# Altium schematic sheet voltage_conditioning.SchDoc
size A4; SheetNumber: 5; SheetTotal: 12
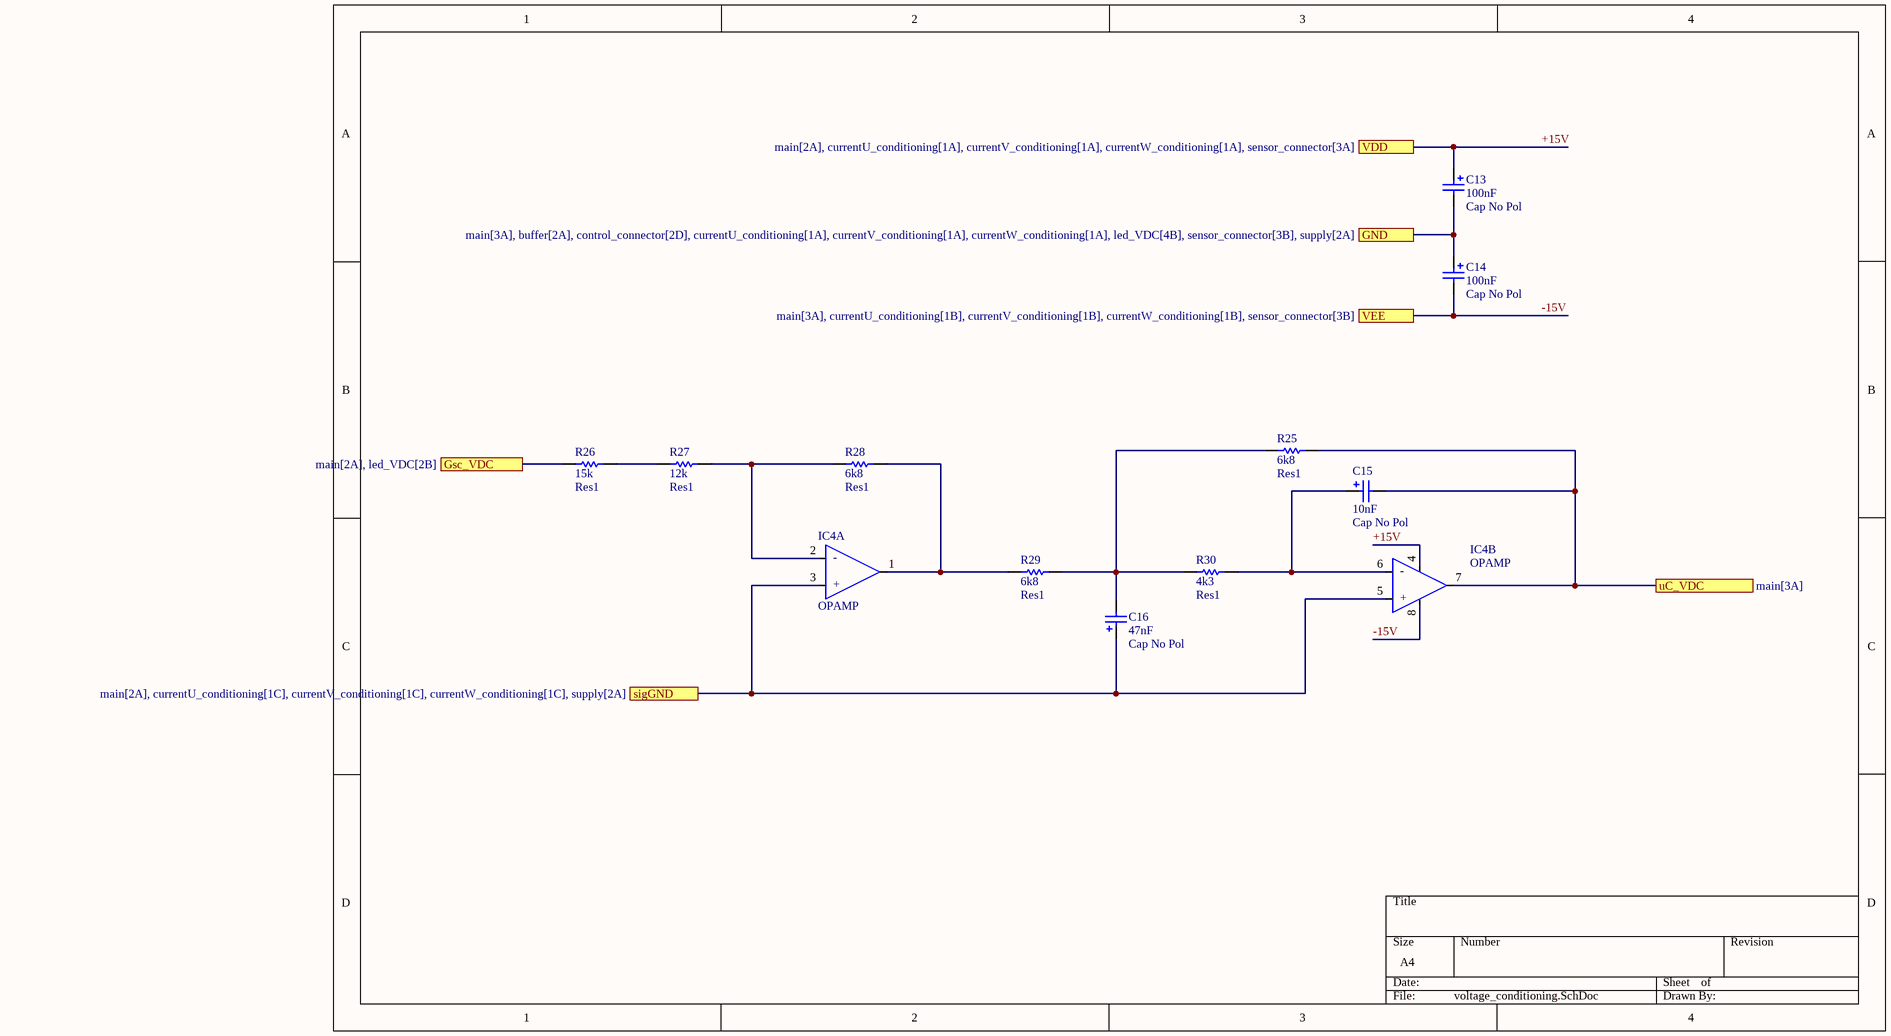
[diagram p0: voltage_conditioning.SchDoc]

## Parts
C13  Cap No Pol  value 100nF  [RAD-0.1]
C14  Cap No Pol  value 100nF  [RAD-0.1]
C15  Cap No Pol  value 10nF  [RAD-0.1]
C16  Cap No Pol  value 47nF  [RAD-0.1]
IC4  OPAMP  [DIP-8]  (parts A,B of 2)
R25  Res1  value 6k8  [AXIAL-0.3]
R26  Res1  value 15k  [AXIAL-0.3]
R27  Res1  value 12k  [AXIAL-0.3]
R28  Res1  value 6k8  [AXIAL-0.3]
R29  Res1  value 6k8  [AXIAL-0.3]
R30  Res1  value 4k3  [AXIAL-0.3]

## Ports
GND (see main[3A], buffer[2A], control_connector[2D], currentU_conditioning[1A], currentV_conditioning[1A], currentW_conditioning[1A], led_VDC[4B], sensor_connector[3B], supply[2A]), Gsc_VDC (see main[2A], led_VDC[2B]), sigGND (see main[2A], currentU_conditioning[1C], currentV_conditioning[1C], currentW_conditioning[1C], supply[2A]), uC_VDC (see main[3A]), VDD (see main[2A], currentU_conditioning[1A], currentV_conditioning[1A], currentW_conditioning[1A], sensor_connector[3A]), VEE (see main[3A], currentU_conditioning[1B], currentV_conditioning[1B], currentW_conditioning[1B], sensor_connector[3B])

## Nets
+15V: C13.1 IC4.4(-V) ; port VDD
-15V: C14.2 IC4.8(V+) ; port VEE
GND: C13.2 C14.1 ; port GND
Gsc_VDC: R26.1 ; port Gsc_VDC
sigGND: C16.1 IC4.3(IN_A_+) IC4.5(IN_B_+) ; port sigGND
uC_VDC: C15.2 IC4.7(OUT_B) R25.2 ; port uC_VDC
NetC15_1: C15.1 IC4.6(IN_B_-) R30.2
NetC16_2: C16.2 R25.1 R29.2 R30.1
NetIC4_1: IC4.1(OUT_A) R28.2 R29.1
NetIC4_2: IC4.2(IN_A_-) R27.2 R28.1
NetR26_2: R26.2 R27.1

## Notes on the sheet
- (in symbol ADTL082, part A) -; +
- (in symbol ADTL082, part B) -; +

## Library data of the parts
C13-C16 = Cap No Pol: Polarized Capacitor (Radial); Published: 8-Jun-2000; LatestRevisionDate: 17-Jul-2002; LatestRevisionNote: Re-released for DXP Platform.; PackageReference: RB7.6-15; Publisher: Altium Limited; PackageDescription: Polarized Capacitor (Radial); 2 Leads
IC4 = ADTL082
R25-R30 = Res1: Resistor; Published: 8-Jun-2000; LatestRevisionDate: 17-Jul-2002; LatestRevisionNote: Re-released for DXP Platform.; PackageReference: AXIAL-0.3; Publisher: Altium Limited; PackageDescription: Axial Device, Thru-Hole; 2 Leads; 0.3 in Pin Spacing